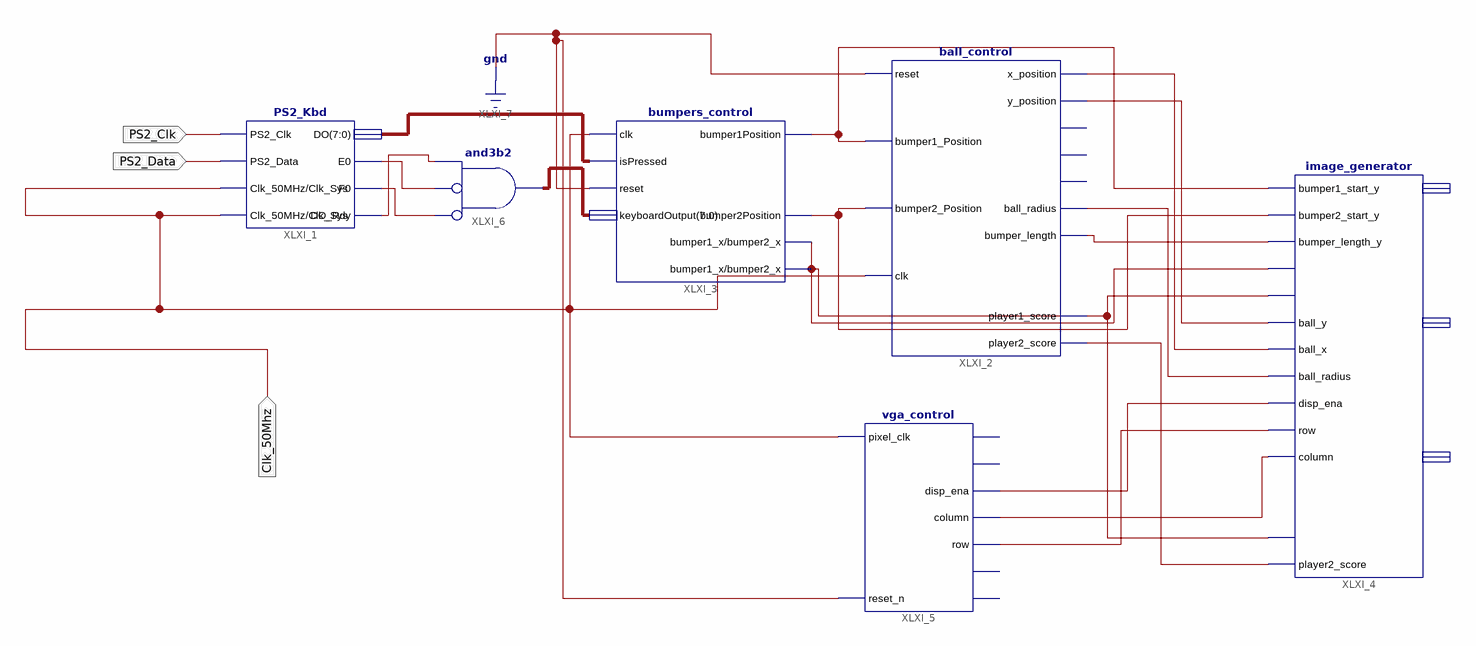
[diagram p0: schematic sheet 1]
// Xilinx ISE schematic project_schemat.sch (artix7) as structural Verilog: 6 symbols, 3 ports
module project_schemat (
  input  Clk_50Mhz,
  input  PS2_Clk,
  input  PS2_Data
);

  wire XLXN_3, XLXN_4, XLXN_5, XLXN_21, XLXN_22, XLXN_23, XLXN_24, XLXN_25, XLXN_26, XLXN_28, XLXN_29,
       XLXN_30, XLXN_31, XLXN_39;
  wire [7:0] XLXN_19, XLXN_42;

  PS2_Kbd XLXI_1 (
    .PS2_Clk(PS2_Clk), .PS2_Data(PS2_Data), .Clk_50MHz(Clk_50Mhz), .E0(XLXN_3), .F0(XLXN_4), .DO_Rdy(XLXN_5),
    .DO(XLXN_42), .Clk_Sys(Clk_50Mhz));
  ball_control XLXI_2 (
    .reset(1'b0), .bumper1_Position(XLXN_22), .bumper2_Position(XLXN_21), .clk(Clk_50Mhz),
    .player1_score(XLXN_31), .player2_score(XLXN_39), .x_position(XLXN_23), .y_position(XLXN_24),
    .ball_radius(XLXN_25), .bumper_length(XLXN_26));  // open: test_vertical, test_horizontal, game_finished
  bumpers_control XLXI_3 (
    .clk(Clk_50Mhz), .isPressed(XLXN_42), .reset(1'b0), .keyboardOutput(XLXN_19), .bumper1Position(XLXN_22),
    .bumper2Position(XLXN_21), .bumper1_x(XLXN_31), .bumper2_x(XLXN_31));
  image_generator XLXI_4 (
    .bumper1_start_y(XLXN_22), .bumper2_start_y(XLXN_21), .bumper_length_y(XLXN_26), .bumper1_x(XLXN_31),
    .bumper2_x(XLXN_31), .ball_y(XLXN_24), .ball_x(XLXN_23), .ball_radius(XLXN_25), .disp_ena(XLXN_28),
    .row(XLXN_30), .column(XLXN_29), .player1_score(XLXN_31), .player2_score(XLXN_39));  // open: red, green, blue
  vga_control XLXI_5 (
    .pixel_clk(Clk_50Mhz), .reset_n(1'b0), .disp_ena(XLXN_28), .column(XLXN_29), .row(XLXN_30));  // open: h_sync, v_sync, n_blank, n_sync
  assign XLXN_19 = ~{8{XLXN_4}} & ~{8{XLXN_3}} & {8{XLXN_5}};  // and3b2 XLXI_6, 8 bits wide
endmodule
